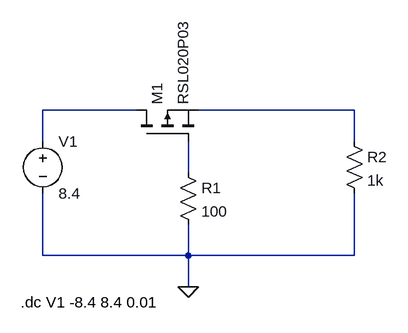
[diagram p0: schematic ReverseProtection.asc]
ReverseProtection.asc, the LTspice schematic file:
Version 4
SHEET 1 880 680
WIRE 144 96 0 96
WIRE 480 96 240 96
WIRE 0 144 0 96
WIRE 480 144 480 96
WIRE 224 192 224 144
WIRE 0 320 0 224
WIRE 224 320 224 272
WIRE 224 320 0 320
WIRE 480 320 480 224
WIRE 480 320 224 320
WIRE 224 368 224 320
FLAG 224 368 0
SYMBOL pmos 144 144 R270
SYMATTR InstName M1
SYMATTR Value RSL020P03
SYMBOL res 208 176 R0
SYMATTR InstName R1
SYMATTR Value 100
SYMBOL res 464 128 R0
SYMATTR InstName R2
SYMATTR Value 1k
SYMBOL voltage 0 128 R0
SYMATTR InstName V1
SYMATTR Value 8.4
TEXT -34 392 Left 2 !.dc V1 -8.4 8.4 0.01

The netlist it stands for:
* ReverseProtection.asc
M1 N001 N003 N002 N002 RSL020P03
R1 N003 0 100
R2 N002 0 1k
V1 N001 0 8.4
.model NMOS NMOS
.model PMOS PMOS
.lib standard.mos
.dc V1 -8.4 8.4 0.01
.backanno
.end